# Altium schematic sheet FireFly_AB.SchDoc: RFSOC_SAWG
size 420 x 297 mm; PageSetup: Record=PageOptions|CenterHorizontal=True|CenterVertical=True|PrintScale=0.97|XCorrection=1.00|YCorrection=1.00|PrintKind=0|BorderSize=5000000|LeftOffset=0|BottomOffset=0|Orientation=2|PaperLength=2970|PaperWidth=2100|Scale=100|PaperSource=7|PrintQuality=-4|MediaType=1|DitherType=10|PrintScaleMode=1|PaperKind=A4|PaperIndex=9; Author: G.Kasprowicz; CompanyName: WUT ISE; DrawnBy: G.Kasprowicz; Organization: WUT ISE; Address1: PW ISE; Address2: Nowowiejska 15/19 00-665 Warsaw; Address3: gkasprow@gmail.com; DocumentNumber: 13; Revision: 1; SheetNumber: 13; SheetTotal: 20; ModifiedBy: -; CheckedDate: -; Title2: FireFly AB; DivGrp: WUT ISE; Designer: G.Kasprowicz; ModifiedDate: -; ProjectName: Sensor Box
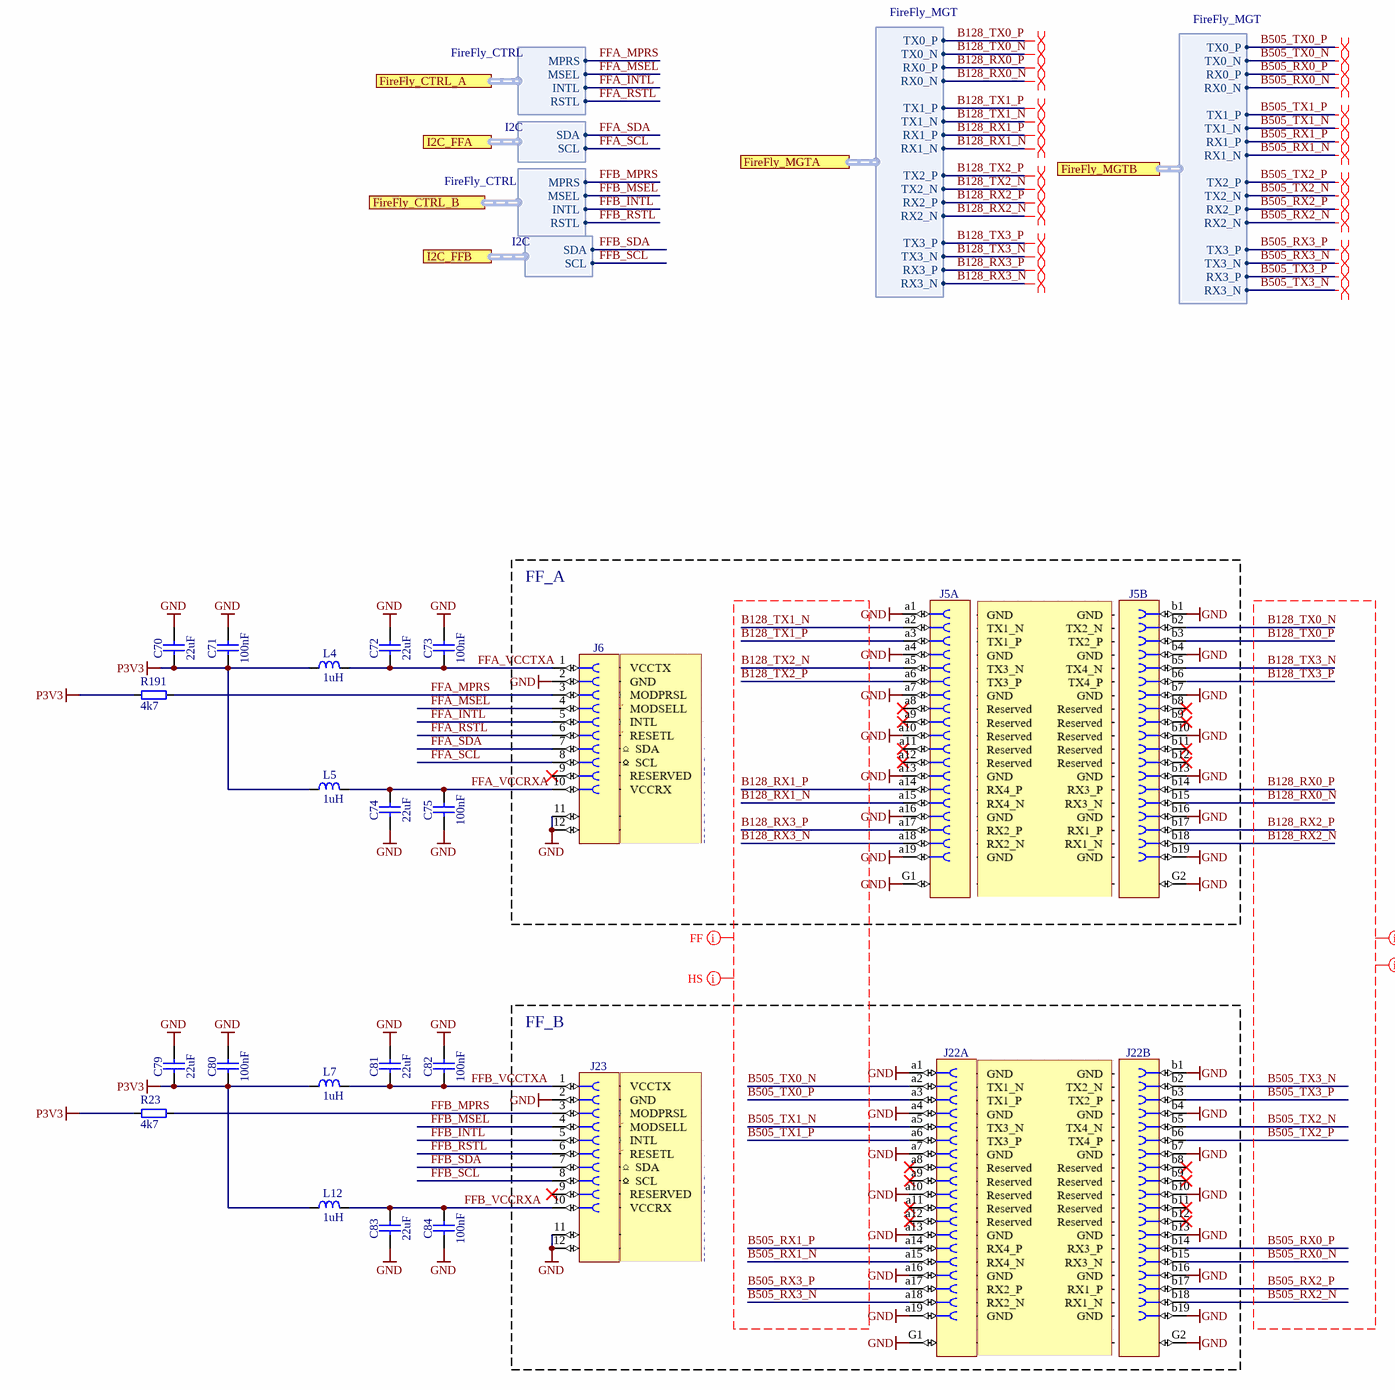
[diagram p0: FireFly_AB.SchDoc]

## Parts
C70  22uF  [CAPC2012X135N]
C71  100nF  [CAPC1005X55N]
C72  22uF  [CAPC2012X135N]
C73  100nF  [CAPC1005X55N]
C74  22uF  [CAPC2012X135N]
C75  100nF  [CAPC1005X55N]
C79  22uF  [CAPC2012X135N]
C80  100nF  [CAPC1005X55N]
C81  22uF  [CAPC2012X135N]
C82  100nF  [CAPC1005X55N]
C83  22uF  [CAPC2012X135N]
C84  100nF  [CAPC1005X55N]
J5  Socket 38  [SAMTEC_UEC5-019-2-H-D-RA-1]  (value not drawn)  (parts A,B of 2)
J6  Socket 10  [SAMTEC_UCC8-010-1-H-S-1-A]  (value not drawn)
J22  Socket 38  [SAMTEC_UEC5-019-2-H-D-RA-1]  (value not drawn)  (parts A,B of 2)
J23  Socket 10  [SAMTEC_UCC8-010-1-H-S-1-A]  (value not drawn)
L4  1uH  [INDC2520X120N]
L5  1uH  [INDC2520X120N]
L7  1uH  [INDC2520X120N]
L12  1uH  [INDC2520X120N]
R23  4k7  [RESC1005X40N]
R191  4k7  [RESC1005X40N]

## Blocks framed on the sheet
FF_A: J5 J6
FF_B: J22 J23

## Ports
FireFly_CTRL_A (harness FireFly_CTRL), FireFly_CTRL_B (harness FireFly_CTRL), FireFly_MGTA (harness FireFly_MGT), FireFly_MGTB (harness FireFly_MGT), I2C_FFA (harness I2C), I2C_FFB (harness I2C)

## Harnesses
I2C: SDA, SCL
FireFly_MGT: RX1_P, RX1_N, RX2_P, RX2_N, RX3_P, RX3_N, RX0_P, RX0_N, TX1_P, TX1_N, TX2_P, TX2_N, TX3_P, TX3_N, TX0_P, TX0_N
FireFly_CTRL: MPRS, MSEL, INTL, RSTL

## Nets
GND: C70.2 C71.2 C72.2 C73.2 C74.1 C75.1 C79.2 C80.2 C81.2 C82.2 C83.1 C84.1 J5.a1 J5.a4 J5.a7 J5.a10 J5.a13 J5.a16 J5.a19 J5.b1 J5.b4 J5.b7 J5.b10 J5.b13 J5.b16 J5.b19 J5.G1 J5.G2 J6.2 J6.11 J6.12 J22.a1 J22.a4 J22.a7 J22.a10 J22.a13 J22.a16 J22.a19 J22.b1 J22.b4 J22.b7 J22.b10 J22.b13 J22.b16 J22.b19 J22.G1 J22.G2 J23.2 J23.11 J23.12
P3V3: C70.1 C71.1 C79.1 C80.1 L4.1 L5.1 L7.1 L12.1 R23.1 R191.1
B128_RX0_N: J5.b15 ; port FireFly_MGTA.RX0_N
B128_RX0_P: J5.b14 ; port FireFly_MGTA.RX0_P
B128_RX1_N: J5.a15 ; port FireFly_MGTA.RX1_N
B128_RX1_P: J5.a14 ; port FireFly_MGTA.RX1_P
B128_RX2_N: J5.b18 ; port FireFly_MGTA.RX2_N
B128_RX2_P: J5.b17 ; port FireFly_MGTA.RX2_P
B128_RX3_N: J5.a18 ; port FireFly_MGTA.RX3_N
B128_RX3_P: J5.a17 ; port FireFly_MGTA.RX3_P
B128_TX0_N: J5.b2 ; port FireFly_MGTA.TX0_N
B128_TX0_P: J5.b3 ; port FireFly_MGTA.TX0_P
B128_TX1_N: J5.a2 ; port FireFly_MGTA.TX1_N
B128_TX1_P: J5.a3 ; port FireFly_MGTA.TX1_P
B128_TX2_N: J5.a5 ; port FireFly_MGTA.TX2_N
B128_TX2_P: J5.a6 ; port FireFly_MGTA.TX2_P
B128_TX3_N: J5.b5 ; port FireFly_MGTA.TX3_N
B128_TX3_P: J5.b6 ; port FireFly_MGTA.TX3_P
B505_RX0_N: J22.b15 ; port FireFly_MGTB.RX0_N
B505_RX0_P: J22.b14 ; port FireFly_MGTB.RX0_P
B505_RX1_N: J22.a15 ; port FireFly_MGTB.RX1_N
B505_RX1_P: J22.a14 ; port FireFly_MGTB.RX1_P
B505_RX2_N: J22.b18 ; port FireFly_MGTB.RX2_N
B505_RX2_P: J22.b17 ; port FireFly_MGTB.RX2_P
B505_RX3_N: J22.a18 ; port FireFly_MGTB.TX3_N
B505_RX3_P: J22.a17 ; port FireFly_MGTB.TX3_P
B505_TX0_N: J22.a2 ; port FireFly_MGTB.TX0_N
B505_TX0_P: J22.a3 ; port FireFly_MGTB.TX0_P
B505_TX1_N: J22.a5 ; port FireFly_MGTB.TX1_N
B505_TX1_P: J22.a6 ; port FireFly_MGTB.TX1_P
B505_TX2_N: J22.b5 ; port FireFly_MGTB.TX2_N
B505_TX2_P: J22.b6 ; port FireFly_MGTB.TX2_P
B505_TX3_N: J22.b2 ; port FireFly_MGTB.RX3_N
B505_TX3_P: J22.b3 ; port FireFly_MGTB.RX3_P
FFA_INTL: J6.5 ; port FireFly_CTRL_A.INTL
FFA_MPRS: J6.3 R191.2 ; port FireFly_CTRL_A.MPRS
FFA_MSEL: J6.4 ; port FireFly_CTRL_A.MSEL
FFA_RSTL: J6.6 ; port FireFly_CTRL_A.RSTL
FFA_SCL: J6.8 ; port I2C_FFA.SCL
FFA_SDA: J6.7 ; port I2C_FFA.SDA
FFA_VCCRXA: C74.2 C75.2 J6.10 L5.2
FFA_VCCTXA: C72.1 C73.1 J6.1 L4.2
FFB_INTL: J23.5 ; port FireFly_CTRL_B.INTL
FFB_MPRS: J23.3 R23.2 ; port FireFly_CTRL_B.MPRS
FFB_MSEL: J23.4 ; port FireFly_CTRL_B.MSEL
FFB_RSTL: J23.6 ; port FireFly_CTRL_B.RSTL
FFB_SCL: J23.8 ; port I2C_FFB.SCL
FFB_SDA: J23.7 ; port I2C_FFB.SDA
FFB_VCCRXA: C83.2 C84.2 J23.10 L12.2
FFB_VCCTXA: C81.1 C82.1 J23.1 L7.2

Not connected (* = marked no-connect by the designer): J5 a8(8)* a9(9)* a11(11)* a12(12)* b8(8)* b9(9)* b11(11)* b12(12)*; J6 9*; J22 a8(8)* a9(9)* a11(11)* a12(12)* b8(8)* b9(9)* b11(11)* b12(12)*; J23 9*

## Layout directives
net class HS: B128_RX0_N, B128_RX0_P, B128_RX1_N, B128_RX1_P, B128_RX2_N, B128_RX2_P, B128_RX3_N, B128_RX3_P, B128_TX0_N, B128_TX0_P, B128_TX1_N, B128_TX1_P, B128_TX2_N, B128_TX2_P, B128_TX3_N, B128_TX3_P, B505_RX0_N, B505_RX0_P, B505_RX1_N, B505_RX1_P, B505_RX2_N, B505_RX2_P, B505_RX3_N, B505_RX3_P, B505_TX0_N, B505_TX0_P, B505_TX1_N, B505_TX1_P, B505_TX2_N, B505_TX2_P, B505_TX3_N, B505_TX3_P
net class FF: B128_RX0_N, B128_RX0_P, B128_RX1_N, B128_RX1_P, B128_RX2_N, B128_RX2_P, B128_RX3_N, B128_RX3_P, B128_TX0_N, B128_TX0_P, B128_TX1_N, B128_TX1_P, B128_TX2_N, B128_TX2_P, B128_TX3_N, B128_TX3_P, B505_RX0_N, B505_RX0_P, B505_RX1_N, B505_RX1_P, B505_RX2_N, B505_RX2_P, B505_RX3_N, B505_RX3_P, B505_TX0_N, B505_TX0_P, B505_TX1_N, B505_TX1_P, B505_TX2_N, B505_TX2_P, B505_TX3_N, B505_TX3_P
differential pair: B128_RX0_N, B128_RX0_P, B128_RX1_N, B128_RX1_P, B128_RX2_N, B128_RX2_P, B128_RX3_N, B128_RX3_P, B128_TX0_N, B128_TX0_P, B128_TX1_N, B128_TX1_P, B128_TX2_N, B128_TX2_P, B128_TX3_N, B128_TX3_P, B505_RX0_N, B505_RX0_P, B505_RX1_N, B505_RX1_P, B505_RX2_N, B505_RX2_P, B505_RX3_N, B505_RX3_P, B505_TX0_N, B505_TX0_P, B505_TX1_N, B505_TX1_P, B505_TX2_N, B505_TX2_P, B505_TX3_N, B505_TX3_P

## Notes on the sheet
- Project/Equipment
- Document
- Designer
- Drawn by
- Check.by
- Copyright WUT ISE 2020.
  This documentation describes Open Hardware and is licensed under the CERN OHL v.1.2. You may redistribute and modify this documentation under the terms of the CERN OHL v.1.2. (http://ohwr.org/CERNOHL). This documentation is distributed WITHOUT ANY EXPRESS OR IMPLIED WARRANTY, INCLUDING OF MERCHANTABILITY, SATISFACTORY QUALITY AND FITNESS FOR A PARTICULAR PURPOSE. Please see the CERN OHL v.1.2 for applicable conditions.
- Contact
- File
- Last Mod.
- Print Date
- Sheet
- Size
- A3
- of
- Rev

## Library data of the parts
C70 C72 C74 C79 C81 C83 = CC0805_22UF_16V_10%_X5R: Non-polarised capacitor; Part Description: SMD Multilayer Chip Ceramic Capacitor; Manufacturer: GENERIC; Manufacturer1 Part Number: C2012X5R1C226KT; Voltage: 16V; TC: X5R; Tolerance: ±10%; Part Number: CC0805_22UF_16V_10%_X5R; Component Kind: Standard; Component Type: Standard; Pin Count: 2; Value: 22uF; Status: Preferred; Manufacturer Part Number: CC0805_22UF_16V_10%_X5R; Case: 0805; Mounted: Yes; Socket: No; SMD: Yes; Sense: No; Manufacturer1 Example: TDK; Manufacturer1 ComponentHeight: 1.35mm; HelpURL: \\cern.ch\dfs\Applications\Altium\Datasheets\CC0805_X5R_TDK_C.pdf; Author: CERN DEM JLC; CreateDate: 25.10.2012; LatestRevisionDate: 25.10.2012
C71 C73 C75 C80 C82 C84 = CC0402_100NF_16V_10%_X7R: Non-polarised capacitor; Part Description: SMD Multilayer Chip Ceramic Capacitor; Manufacturer: GENERIC; Manufacturer1 Part Number: GRM155R71C104KA88D; Voltage: 16V; TC: X7R; Tolerance: ±10%; Part Number: CC0402_100NF_16V_10%_X7R; Component Kind: Standard; Component Type: Standard; Pin Count: 2; Value: 100nF; Status: Not Recommended; Manufacturer Part Number: CC0402_100NF_16V_10%_X7R; Case: 0402; Mounted: Yes; Socket: No; SMD: Yes; Sense: No; Manufacturer1 Example: MURATA; Manufacturer1 ComponentHeight: 0.55mm; HelpURL: \\cern.ch\dfs\Applications\Altium\Datasheets\CC0402_X7R_MURATA_GRM.pdf; Author: CERN DEM JLC; CreateDate: 05/12/2013; LatestRevisionDate: 03/12/2007
J5 J22 = SAMTEC_UEC5-019-2-H-D-RA-1: Connector 38ab Female (2x19) + 2x1; Part Description: 38 Contacts, Pitch 0.5mm, Rugged Micro Flyover Socket System; Manufacturer: SAMTEC; PressFit: No; Part Number: SAMTEC_UEC5-019-2-H-D-RA-1; Component Kind: Standard; Component Type: Standard; Pin Count: 38; Family: Socket 38; Mounted: Yes; Socket: No; SMD: Yes; Sense: No; Status: None; Manufacturer Part Number: UEC5-019-2-H-D-RA-1; ComponentHeight: 3.46mm; HelpURL: \\cern.ch\dfs\Applications\Altium\Datasheets\SAMTEC_UEC5-019-2-H-D-RA-1.pdf; Author: CERN DEM BR; CreateDate: 06.06.2019; LatestRevisionDate: 06.06.2019
J6 J23 = SAMTEC_UCC8-010-1-H-S-1-A: Connector 10 Female + 2; Part Description: 10 Contacts, Pitch 0.8mm, Rugged Micro Flyover Socket System; Manufacturer: SAMTEC; PressFit: No; Part Number: SAMTEC_UCC8-010-1-H-S-1-A; Component Kind: Standard; Component Type: Standard; Pin Count: 10; Family: Socket 10; Mounted: Yes; Socket: No; SMD: Yes; Sense: No; Status: None; Manufacturer Part Number: UCC8-010-1-H-S-1-A; ComponentHeight: 3.95mm; HelpURL: \\cern.ch\dfs\Applications\Altium\Datasheets\SAMTEC_UCC8-010-1-H-S-1-A.pdf; Author: CERN DEM JLC; CreateDate: 09.06.2015; LatestRevisionDate: 09.06.2015
L4 L5 L7 L12 = IND1008_1UH_20%_TDK_TFM252012ALVA1R0M: Inductor; Part Description: Inductors for Power Circuits Thin-Film Metal Magnetic Material (TFM-ALVA Series for Automotive); Manufacturer: TDK; Tolerance: ±20%; Power: 4.7A; Resistance: 0.035R; Case: 1008; Value: 1uH; HelpURL: \\cern.ch\dfs\Applications\Altium\Datasheets\IND_TDK_TFM252012ALVA.pdf; Part Number: IND1008_1UH_20%_TDK_TFM252012ALVA1R0M; Component Kind: Standard; Component Type: Standard; Pin Count: 2; Manufacturer Part Number: TFM252012ALVA1R0M; Mounted: Yes; Socket: No; SMD: Yes; Sense: No; ComponentHeight: 1.2mm; Author: CERN DEM BC; CreateDate: 16.04.2020; LatestRevisionDate: 16.04.2020
R23 R191 = R0402_4K7_1%_0.0625W_100PPM: Resistor - 1%; Part Description: General Purpose Thick Film Chip Resistor; Manufacturer: GENERIC; Manufacturer1 Part Number: 232270674702L; TC: ±100ppm/°C; PressFit: No; Case: 0402; Value: 4k7; Tolerance: ±1%; Part Number: R0402_4K7_1%_0.0625W_100PPM; Component Kind: Standard; Component Type: Standard; Pin Count: 2; Status: Not Recommended; Power: 0.0625W; Manufacturer Part Number: R0402_4K7_1%_0.0625W_100PPM; Mounted: Yes; Sense: No; Socket: No; SMD: Yes; Manufacturer1 Example: YAGEO PHYCOMP; Manufacturer1 ComponentHeight: 0.4mm; HelpURL: \\cern.ch\dfs\Applications\Altium\Datasheets\R0402_Phycomp_RC0402.pdf; Author: CERN DEM JLC; CreateDate: 03.12.2007; LatestRevisionDate: 17.10.2012